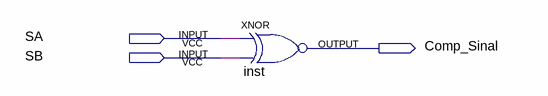
[diagram p0: schematic sheet]
// Quartus schematic Compatador_Sinal.bdf as structural Verilog: 1 symbols, 3 pins
module Compatador_Sinal (
  input  SA,
  input  SB,
  output Comp_Sinal
);

  xnor inst (Comp_Sinal, SA, SB);
endmodule
